# EAGLE design cpu-18f4455 (EAGLE 6.5.0)
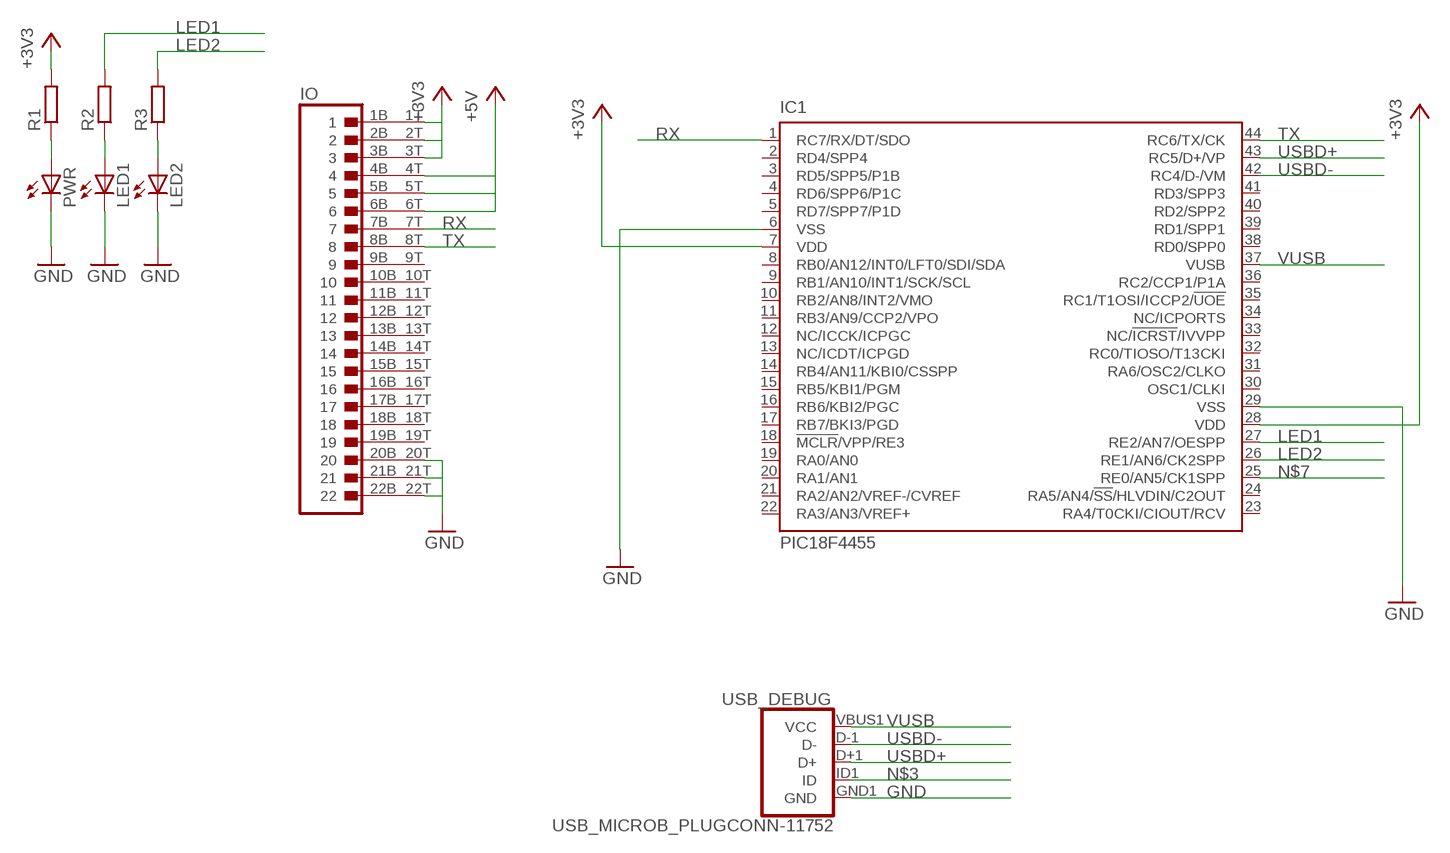
[diagram p0: schematic, sheet 1]

## Parts
IC1  PIC18F4455  PIC18F4455_TQFP  [TQFP44]
IO  SIMBRD22  [SIMBRD22]
LED1  LED1206  [LED-1206]
LED2  LED1206  [LED-1206]
PWR  LED1206  [LED-1206]
R1  R-EU_R0805  [R0805]
R2  R-EU_R0805  [R0805]
R3  R-EU_R0805  [R0805]
USB_DEBUG  USB_MICROB_PLUGCONN-11752  [USB-B-MICRO-SMD_V03]

## Nets
+3V3: IC1.7(VDD) IC1.28(VDD) IO.1T(A1) IO.2T(A2) IO.3T(A3) R1.2
+5V: IO.4T(A4) IO.5T(A5) IO.6T(A6)
GND: IC1.6(VSS) IC1.29(VSS) IO.20T(A20) IO.21T(A21) IO.22T(A22) LED1.C LED2.C PWR.C USB_DEBUG.GND1(GND)
LED1: IC1.27(RE2/AN7/OESPP) R2.2
LED2: IC1.26(RE1/AN6/CK2SPP) R3.2
N$1: PWR.A R1.1
N$2: LED1.A R2.1
N$3: USB_DEBUG.ID1(ID)
N$4: LED2.A R3.1
N$7: IC1.25(RE0/AN5/CK1SPP)
RX: IC1.1(RC7/RX/DT/SDO) IO.7T(A7)
TX: IC1.44(RC6/TX/CK) IO.8T(A8)
USBD+: IC1.43(RC5/D+/VP) USB_DEBUG.D+1(D+)
USBD-: IC1.42(RC4/D-/VM) USB_DEBUG.D-1(D-)
VUSB: IC1.37(VUSB) USB_DEBUG.VBUS1(VCC)
Unconnected: IC1.2(RD4/SPP4) IC1.3(RD5/SPP5/P1B) IC1.4(RD6/SPP6/P1C) IC1.5(RD7/SPP7/P1D) IC1.8(RB0/AN12/INT0/LFT0/SDI/SDA) IC1.9(RB1/AN10/INT1/SCK/SCL) IC1.10(RB2/AN8/INT2/VMO) IC1.11(RB3/AN9/CCP2/VPO) IC1.12(NC/ICCK/ICPGC) IC1.13(NC/ICDT/ICPGD) IC1.14(RB4/AN11/KBI0/CSSPP) IC1.15(RB5/KBI1/PGM) IC1.16(RB6/KBI2/PGC) IC1.17(RB7/BKI3/PGD) IC1.18(!MCLR!/VPP/RE3) IC1.19(RA0/AN0) IC1.20(RA1/AN1) IC1.21(RA2/AN2/VREF-/CVREF) IC1.22(RA3/AN3/VREF+) IC1.23(RA4/T0CKI/CIOUT/RCV) IC1.24(RA5/AN4/!SS!/HLVDIN/C2OUT) IC1.30(OSC1/CLKI) IC1.31(RA6/OSC2/CLKO) IC1.32(RC0/TIOSO/T13CKI) IC1.33(NC/!ICRST!/IVVPP) IC1.34(NC/ICPORTS) IC1.35(RC1/T1OSI/ICCP2/!UOE) IC1.36(RC2/CCP1/P1A) IC1.38(RD0/SPP0) IC1.39(RD1/SPP1) IC1.40(RD2/SPP2) IC1.41(RD3/SPP3) IO.1B IO.2B IO.3B IO.4B IO.5B IO.6B IO.7B IO.8B IO.9B IO.9T(A9) IO.10B IO.10T(A10) IO.11B IO.11T(A11) IO.12B IO.12T(A12) IO.13B IO.13T(A13) IO.14B IO.14T(A14) IO.15B IO.15T(A15) IO.16B IO.16T(A16) IO.17B IO.17T(A17) IO.18B IO.18T(A18) IO.19B IO.19T(A19) IO.20B IO.21B IO.22B

## Library data of the parts
IC1 = microchip:PIC18F4*_TQFP: USB Microcontrollers with nanoWatt Technology High-Performance, Enhanced Flash, 28/40/44-Pin, Source: http://ww1.microchip.com/downloads/en/devicedoc/39632c.pdf; MF: MICROCHIP; MPN: PIC18F4455-I/PT; OC_FARNELL: 9321322; OC_NEWARK: 08J9628
IO = con-amp:SIMBRD22: AMP connector
LED1 LED2 PWR = SparkFun-LED:LED: LEDs Standard schematic elements and footprints for 5mm, 3mm, 1206, and 0603 sized LEDs. 5mm - Spark Fun Electronics SKU : COM-00529 (and others)
R1-R3 = rcl:R-EU_: RESISTOR, European symbol
USB_DEBUG = SparkFun-Connectors:USB_MICROB_PLUG: USB Micro-B Plug Comes in a variety of packages. Check out Hirose's ZX-x0 line: http://www.hirose.co.jp/cataloge_hp/e24200011.pdf; PROD_ID: CONN-11752

## Board
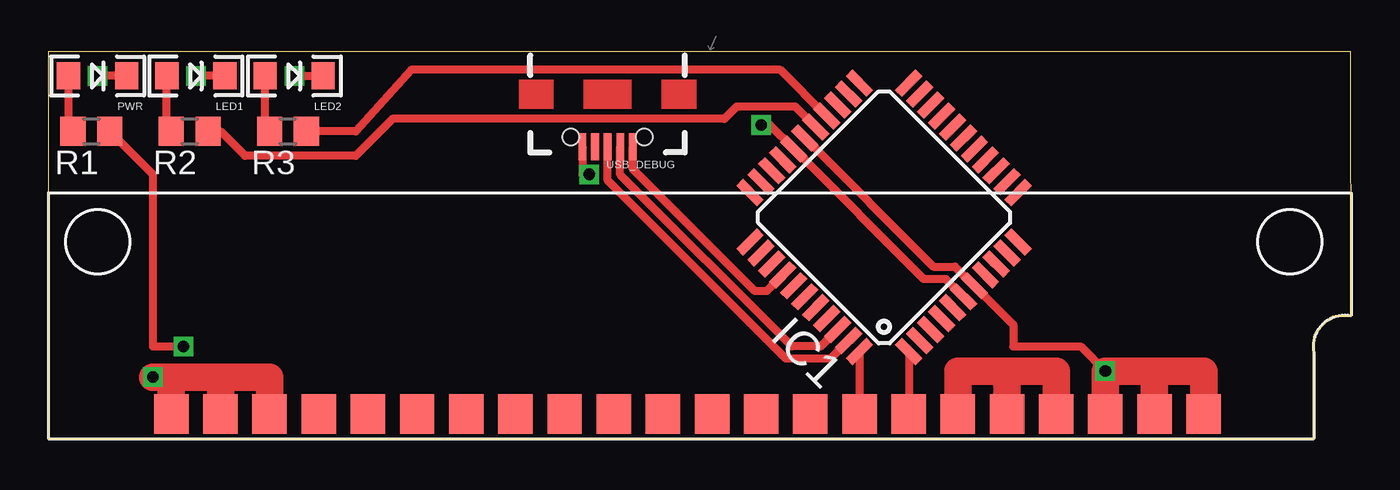
[diagram p1: board, top side]
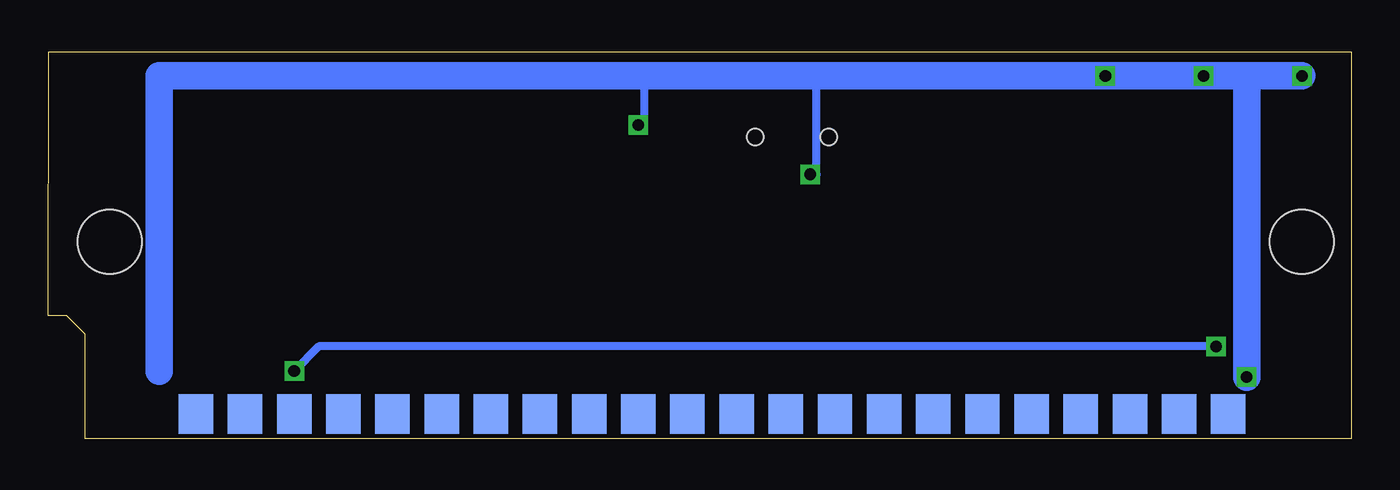
[diagram p2: board, bottom side, seen from below]

Size 67.31 x 19.99 mm. Coordinates in mm from the lower left corner, seen from the top.
Outline: 0,0 65.41,0 65.41,5.4 66.36,6.35 67.31,6.35 67.3,19.99 0,19.99 0,0
Copper layers (1*16): Top 0.035mm / dielectric 1.5mm / Bottom 0.035mm
Design rules "default": minimum track width 10mil, minimum drill 24mil, track to track 8mil, track to pad 8mil, pad to pad 8mil, via to via 8mil, smd to smd 8mil, copper to edge 40mil, drill to drill 8mil, minimum pad ring 10mil, minimum via ring 8mil, stop-mask expansion 4mil, vias tented up to drill 0mil, thermal gap 10mil

### Footprints (pad centres in the part's own frame; a part is rotated, then mirrored left to right if it is on the bottom)
TQFP44 = smd 1.5 x 0.5: 1 -5.8,4; 2 -5.8,3.2; 3 -5.8,2.4; 4 -5.8,1.6; 5 -5.8,0.8; 6 -5.8,0; 7 -5.8,-0.8; 8 -5.8,-1.6; 9 -5.8,-2.4; 10 -5.8,-3.2; 11 -5.8,-4; 23 5.8,-4; 24 5.8,-3.2; 25 5.8,-2.4; 26 5.8,-1.6; 27 5.8,-0.8; 28 5.8,0; 29 5.8,0.8; 30 5.8,1.6; 31 5.8,2.4; 32 5.8,3.2; 33 5.8,4 | smd 0.5 x 1.5: 12 -4,-5.8; 13 -3.2,-5.8; 14 -2.4,-5.8; 15 -1.6,-5.8; 16 -0.8,-5.8; 17 0,-5.8; 18 0.8,-5.8; 19 1.6,-5.8; 20 2.4,-5.8; 21 3.2,-5.8; 22 4,-5.8; 34 4,5.8; 35 3.2,5.8; 36 2.4,5.8; 37 1.6,5.8; 38 0.8,5.8; 39 0,5.8; 40 -0.8,5.8; 41 -1.6,5.8; 42 -2.4,5.8; 43 -3.2,5.8; 44 -4,5.8
SIMBRD22 = smd 1.778 x 2.032 bottom: 1B 26.67,-6.35; 2B 24.13,-6.35; 3B 21.59,-6.35; 4B 19.05,-6.35; 5B 16.51,-6.35; 6B 13.97,-6.35; 7B 11.43,-6.35; 8B 8.89,-6.35; 9B 6.35,-6.35; 10B 3.81,-6.35; 11B 1.27,-6.35; 12B -1.27,-6.35; 13B -3.81,-6.35; 14B -6.35,-6.35; 15B -8.89,-6.35; 16B -11.43,-6.35; 17B -13.97,-6.35; 18B -16.51,-6.35; 19B -19.05,-6.35; 20B -21.59,-6.35; 21B -24.13,-6.35; 22B -26.67,-6.35 | smd 1.778 x 2.032: 1T 26.67,-6.35; 2T 24.13,-6.35; 3T 21.59,-6.35; 4T 19.05,-6.35; 5T 16.51,-6.35; 6T 13.97,-6.35; 7T 11.43,-6.35; 8T 8.89,-6.35; 9T 6.35,-6.35; 10T 3.81,-6.35; 11T 1.27,-6.35; 12T -1.27,-6.35; 13T -3.81,-6.35; 14T -6.35,-6.35; 15T -8.89,-6.35; 16T -11.43,-6.35; 17T -13.97,-6.35; 18T -16.51,-6.35; 19T -19.05,-6.35; 20T -21.59,-6.35; 21T -24.13,-6.35; 22T -26.67,-6.35 | hole 3.302: -30.48,2.54; 31.115,2.54
LED-1206 = smd 1.2 x 1.4: A -1.5,0; C 1.5,0
R0805 = smd 1.3 x 1.5: 1 -0.95,0; 2 0.95,0
USB-B-MICRO-SMD_V03 = smd 1.4 x 0.4: D+1 2.7,0; D-1 2.7,0.65; GND1 2.7,-1.3; ID1 2.7,-0.65; VBUS1 2.7,1.3 | hole 0.85: 2.2,1.9; 2.2,-1.9

### Placement (x,y rotation side)
IC1  43.18,11.43 135 top
IO  33.02,7.62 0 top
LED1  7.62,18.73 0 top
LED2  12.7,18.73 0 top
PWR  2.54,18.73 0 top
R1  2.22,15.88 0 top
R2  7.3,15.88 0 top
R3  12.38,15.88 0 top
USB_DEBUG  28.89,17.78 270 top

### Tracks (layer width: path | path; a pad name or v marks a point on that pad's centre or on a via)
+3V3  (via drill 0.6)
  Top 0.406: 49.85,4.76 | 49.85,4.76 53.34,4.76 v54.61,3.49 | R1.2 5.4,13.65 5.4,4.76 v6.99,4.76 | IC1.28 45.72,8.89 46.85,8.89 IC1.7 49.85,5.89 49.85,4.76
  Top 1.422: IO.1T 59.69,3.49 57.15,3.49 | 57.15,3.49 v54.61,3.49 IO.3T | IO.2T 57.15,3.49
  Bottom 0.406: v6.99,4.76 53.34,4.76 v54.61,3.49
+5V
  Top 1.422: IO.4T 52.07,3.49 49.85,3.49 49.53,3.49 | 49.53,3.49 46.99,3.49 IO.6T | IO.5T 49.53,3.49
GND  (via drill 0.6)
  Top 0.406: PWR.C v2.54,18.73 | v12.7,18.73 LED2.C | LED1.C v7.62,18.73 | USB_DEBUG.GND1 27.59,13.65 v27.94,13.65 | IC1.6 46.35,8.26 45.22,8.26 IC1.29 37.29,16.19 v36.83,16.19
  Top 1.422: v5.4,3.17 6.35,3.17 | 6.35,3.17 IO.22T | IO.21T 8.89,3.17 | 8.89,3.17 6.35,3.17 | IO.20T 11.43,3.17 8.89,3.17
  Bottom 0.406: v27.94,13.65 27.62,13.65 27.62,18.73 | v36.83,16.19 36.51,16.51 36.51,18.73
  Bottom 1.422: v2.54,18.73 v7.62,18.73 | v7.62,18.73 v12.7,18.73 27.62,18.73 36.51,18.73 61.59,18.73 61.59,3.49 | v7.62,18.73 5.4,18.73 v5.4,3.17
LED1
  Top 0.406: IC1.27 38.6,17.14 35.56,17.14 34.92,16.51 17.78,16.51 15.88,14.61 10.16,14.61 8.89,15.88 R2.2
LED2
  Top 0.406: R3.2 15.88,15.88 18.73,19.05 37.82,19.05 IC1.26
N$1
  Top 0.406: R1.1 1.04,16.19 PWR.A
N$2
  Top 0.406: R2.1 6.12,16.19 LED1.A
N$4
  Top 0.406: R3.1 11.2,16.19 LED2.A
RX
  Top 0.406: IC1.1 IO.7T
TX
  Top 0.406: IC1.44 IO.8T
USBD+
  Top 0.406: IC1.43 40.4,4.13 38.1,4.13 28.89,13.34 USB_DEBUG.D+1
USBD-
  Top 0.406: IC1.42 39.91,4.76 38.42,4.76 29.54,13.64 USB_DEBUG.D-1
VUSB
  Top 0.406: IC1.37 37.11,7.62 36.51,7.62 30.19,13.94 USB_DEBUG.VBUS1